# Altium schematic sheet USB.SchDoc: USB UART
size A4; Organization: Energy Auditor; Address1: Sensor Node; Address3: University of Colorado; Address4: Boulder; DocumentNumber: 6; Revision: 1; SheetNumber: 6; SheetTotal: 6
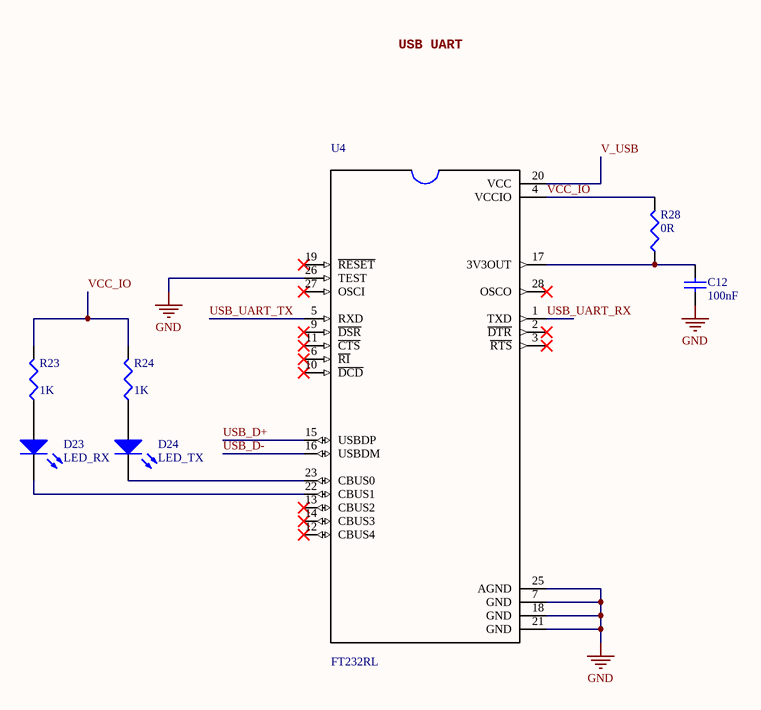
[diagram p0: USB.SchDoc]

## Parts
C12  100nF  [1608[0603]]
D23  LED_RX  [1608[0603]]
D24  LED_TX  [1608[0603]]
R23  1K  [1608[0603]]
R24  1K  [1608[0603]]
R28  0R  [1608[0603]]
U4  FT232RL  [SOP65P780X200-28N]

## Nets
GND: C12.2 U4.7(GND) U4.18(GND) U4.21(GND) U4.25(AGND) U4.26(TEST)
USB_D+: U4.15(USBDP)
USB_D-: U4.16(USBDM)
USB_UART_RX: U4.1(TXD)
USB_UART_TX: U4.5(RXD)
V_USB: U4.20(VCC)
VCC_IO: R23.2 R24.2 R28.2 U4.4(VCCIO)
NetC12_1: C12.1 R28.1 U4.17(3V3OUT)
NetD23_1: D23.1(A) R23.1
NetD23_2: D23.2(K) U4.22(CBUS1)
NetD24_1: D24.1(A) R24.1
NetD24_2: D24.2(K) U4.23(CBUS0)

Not connected (* = marked no-connect by the designer): U4 2(~{DTR})* 3(~{RTS})* 6(~{RI})* 9(~{DSR})* 10(~{DCD})* 11(~{CTS})* 12(CBUS4)* 13(CBUS2)* 14(CBUS3)* 19(~{RESET})* 27(OSCI)* 28(OSCO)*

## Notes on the sheet
- USB UART
- Title
- Size:
- Date:
- A4
- Number:
- Time:
- Revision:
- Sheet
- of
- File:

## Library data of the parts
C12 = Cap: CAP CER 0.1UF 16V X7R 0603; Manufacturer: AVX Corporation; Manufacturer Part Number: 0603YC104MAT4A; Value: 100nF; Digi-Key Part Number: 478-7617-1-ND; ComponentLink1Description: Digi-Key Link; ComponentLink1URL: https://www.digikey.com/products/en/capacitors/ceramic-capacitors/60?k=capacitor&k=&pkeyword=capacitor&pv2049=u0.1%C2%B5F&sf=0&FV=c0005%2C1c0002%2C380009%2C400005%2C1f140000%2Cffe0003c&quantity=&ColumnSort=0&page=1&stock=1&pageSize=25
D23 = LED2: LED RED DIFFUSED 0603 SMD; Manufacturer: OSRAM Opto Semiconductors Inc.; Manufacturer Part Number: LS L29K-H1J2-1-Z; Digi-Key Part Number: 475-1195-1-ND; ComponentLink1URL: https://www.digikey.com/product-detail/en/osram-opto-semiconductors-inc/LG-L29K-F2J1-24-Z/475-3118-1-ND/4899549; ComponentLink1Description: Digi-Key Link
D24 = LED2: LED YELLOW DIFFUSED 0603 SMD; Manufacturer: OSRAM Opto Semiconductors Inc.; Manufacturer Part Number: LY L29K-H1K2-26-Z; Digi-Key Part Number: 475-1196-1-ND; ComponentLink1URL: https://www.digikey.com/product-detail/en/osram-opto-semiconductors-inc/LY-L29K-H1K2-26-Z/475-1196-1-ND/810357; ComponentLink1Description: Digi-Key Link
R23 R24 = Res3: RES SMD 1K OHM 0.1% 1/10W 0603; Manufacturer: Yageo; Manufacturer Part Number: RT0603BRD071KL; Value: 1K; Digi-Key Part Number: YAG1237CT-ND; ComponentLink1URL: https://www.digikey.com/product-detail/en/yageo/RT0603BRD071KL/YAG1237CT-ND/4340590; ComponentLink1Description: Digi-Key Link
R28 = Res3: RES 0 OHM JUMPER 1/8W 0603; Manufacturer: Vishay Beyschlag; Manufacturer Part Number: MCT0603MZ0000ZP500; Value: 0R; Digi-Key Part Number: 749-1745-1-ND; ComponentLink1URL: https://www.digikey.com/product-detail/en/vishay-beyschlag/MCT0603MZ0000ZP500/749-1745-1-ND/7348053; ComponentLink1Description: Digi-Key Link
U4 = FT232RL-REEL: USB Bridge, USB to UART USB 2.0 UART Interface 28-SSOP; Manufacturer: FTDI, Future Technology Devices International Ltd; Value: *; ComponentLink1URL: https://www.digikey.com/product-detail/en/ftdi-future-technology-devices-international-ltd/FT232RL-REEL/768-1007-1-ND/1836402; Digi-Key Part Number: 768-1007-1-ND; ComponentLink1Description: Digi-Key Link; Manufacturer Part Number: FT232RL-REEL